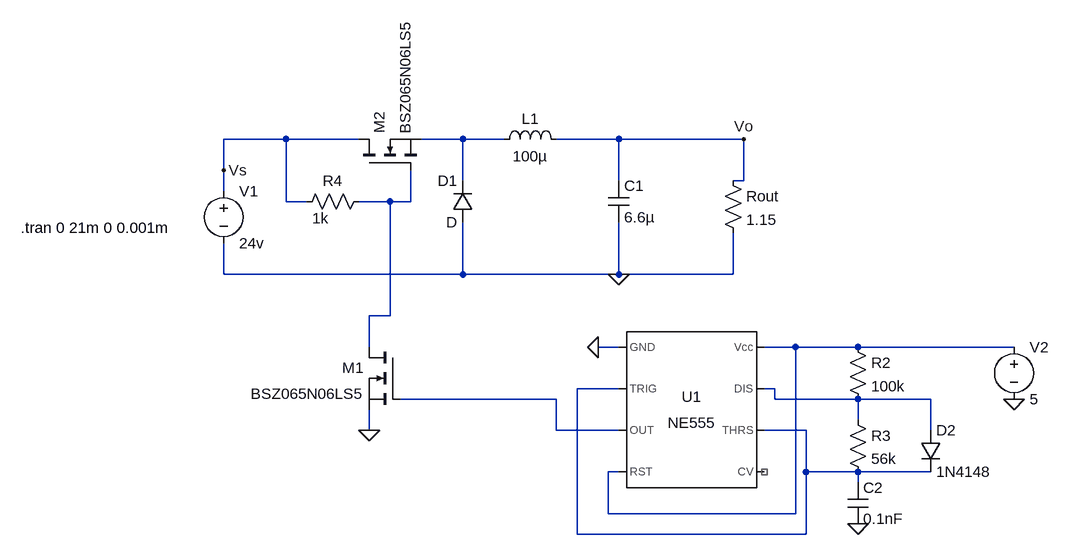
[diagram p0: schematic BuckConverterLtspice.asc]
BuckConverterLtspice.asc, the LTspice schematic file:
Version 4
SHEET 1 2468 724
WIRE 432 112 336 112
WIRE 544 112 432 112
WIRE 704 112 640 112
WIRE 768 112 704 112
WIRE 944 112 848 112
WIRE 1136 112 944 112
WIRE 336 160 336 112
WIRE 704 176 704 112
WIRE 944 176 944 112
WIRE 1136 176 1136 112
WIRE 1136 176 1120 176
WIRE 336 192 336 160
WIRE 432 208 432 112
WIRE 464 208 432 208
WIRE 592 208 544 208
WIRE 624 208 624 160
WIRE 624 208 592 208
WIRE 336 320 336 272
WIRE 704 320 704 240
WIRE 704 320 336 320
WIRE 944 320 944 240
WIRE 944 320 704 320
WIRE 1120 320 1120 256
WIRE 1120 320 944 320
WIRE 592 384 592 208
WIRE 592 384 560 384
WIRE 560 432 560 384
WIRE 944 432 912 432
WIRE 1216 432 1168 432
WIRE 1312 432 1216 432
WIRE 1552 432 1312 432
WIRE 944 496 880 496
WIRE 1184 496 1168 496
WIRE 848 512 608 512
WIRE 1184 512 1184 496
WIRE 1312 512 1184 512
WIRE 1424 512 1312 512
WIRE 1312 544 1312 512
WIRE 560 560 560 528
WIRE 848 560 848 512
WIRE 944 560 848 560
WIRE 1232 560 1168 560
WIRE 1424 560 1424 512
WIRE 944 624 928 624
WIRE 1232 624 1232 560
WIRE 1312 624 1232 624
WIRE 1424 624 1312 624
WIRE 1312 640 1312 624
WIRE 928 688 928 624
WIRE 1216 688 1216 432
WIRE 1216 688 928 688
WIRE 880 720 880 496
WIRE 1232 720 1232 624
WIRE 1232 720 880 720
FLAG 944 320 0
FLAG 1136 112 Vo
FLAG 336 160 Vs
FLAG 1312 704 0
FLAG 912 432 0
FLAG 560 560 0
FLAG 1552 512 0
SYMBOL cap 928 176 R0
SYMATTR InstName C1
SYMATTR Value 6.6µ
SYMBOL ind 752 128 R270
WINDOW 0 32 56 VTop 2
WINDOW 3 5 56 VBottom 2
SYMATTR InstName L1
SYMATTR Value 100µ
SYMBOL res 1104 160 R0
SYMATTR InstName Rout
SYMATTR Value 1.15
SYMBOL voltage 336 176 R0
WINDOW 123 0 0 Left 0
WINDOW 39 0 0 Left 0
SYMATTR InstName V1
SYMATTR Value 24v
SYMBOL diode 720 240 R180
WINDOW 0 24 64 Left 2
WINDOW 3 24 0 Left 2
SYMATTR InstName D1
SYMBOL Misc\\NE555 1056 528 R0
SYMATTR InstName U1
SYMBOL res 1296 416 R0
SYMATTR InstName R2
SYMATTR Value 100k
SYMBOL res 1296 528 R0
SYMATTR InstName R3
SYMATTR Value 56k
SYMBOL cap 1296 640 R0
SYMATTR InstName C2
SYMATTR Value 0.1nF
SYMBOL diode 1408 560 R0
SYMATTR InstName D2
SYMATTR Value 1N4148
SYMBOL res 560 192 R90
WINDOW 0 0 56 VBottom 2
WINDOW 3 26 75 VTop 2
SYMATTR InstName R4
SYMATTR Value 1k
SYMBOL voltage 1552 416 R0
WINDOW 123 0 0 Left 0
WINDOW 39 0 0 Left 0
SYMATTR InstName V2
SYMATTR Value 5
SYMBOL nmos 608 432 M0
SYMATTR InstName M1
SYMATTR Value BSZ065N06LS5
SYMBOL nmos 544 160 R270
SYMATTR InstName M2
SYMATTR Value BSZ065N06LS5
TEXT 24 248 Left 2 !.tran 0 21m 0 0.001m

The netlist it stands for:
* BuckConverterLtspice.asc
C1 Vo 0 6.6µ
L1 N001 Vo 100µ
Rout Vo 0 1.15
V1 Vs 0 24v
D1 0 N001 D
XU1 0 N004 N006 N003 NC_01 N004 N005 N003 NE555  ; pins GND TRIG OUT RST CV THRS DIS Vcc
R2 N003 N005 100k
R3 N005 N004 56k
C2 N004 0 0.1nF
D2 N005 N004 1N4148
R4 N002 Vs 1k
V2 N003 0 5
M1 N002 N006 0 0 BSZ065N06LS5
M2 Vs N002 N001 N001 BSZ065N06LS5
.model D D
.lib standard.dio
.model NMOS NMOS
.model PMOS PMOS
.lib standard.mos
.tran 0 21m 0 0.001m
.lib NE555.sub
.backanno
.end